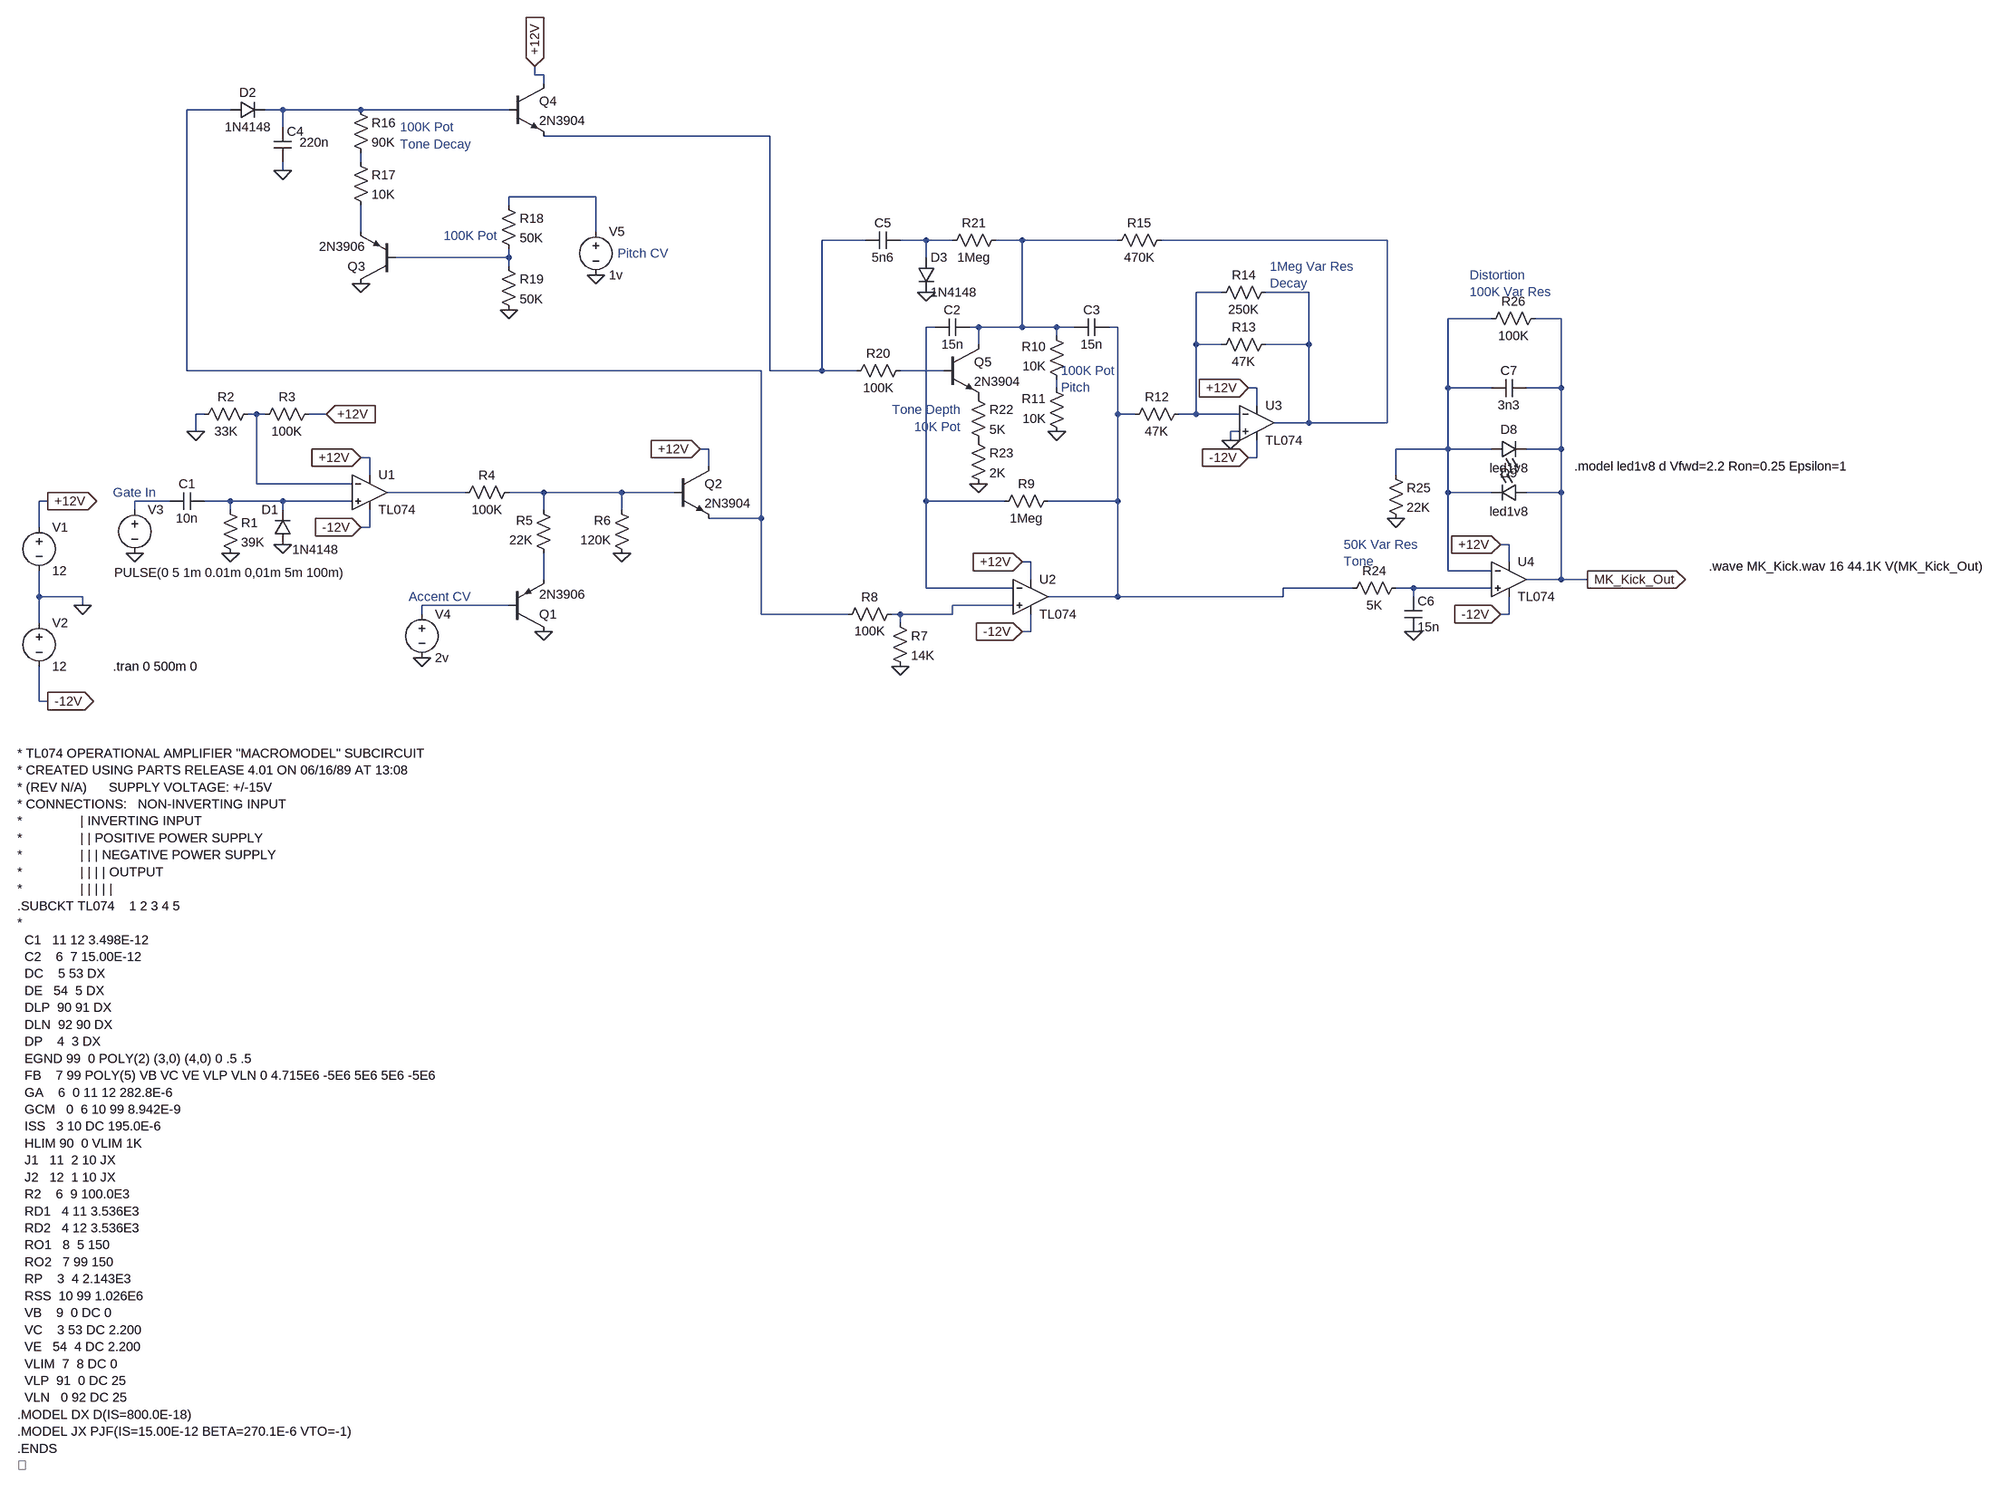
[diagram p0: schematic Kick_design.asc]
Kick_design.asc, the LTspice schematic file:
Version 4
SHEET 1 3896 1752
WIRE 736 -688 736 -704
WIRE 752 -688 736 -688
WIRE 752 -672 752 -688
WIRE 176 -624 96 -624
WIRE 272 -624 240 -624
WIRE 416 -624 272 -624
WIRE 688 -624 416 -624
WIRE 272 -592 272 -624
WIRE 1168 -576 752 -576
WIRE 416 -528 416 -544
WIRE 272 -512 272 -528
WIRE 848 -464 688 -464
WIRE 688 -448 688 -464
WIRE 416 -400 416 -448
WIRE 848 -400 848 -464
WIRE 1344 -384 1264 -384
WIRE 1456 -384 1408 -384
WIRE 1504 -384 1456 -384
WIRE 1632 -384 1584 -384
WIRE 1808 -384 1632 -384
WIRE 2304 -384 1888 -384
WIRE 688 -352 688 -368
WIRE 688 -352 480 -352
WIRE 1456 -352 1456 -384
WIRE 688 -336 688 -352
WIRE 2000 -288 1952 -288
WIRE 2160 -288 2080 -288
WIRE 2496 -240 2416 -240
WIRE 2624 -240 2576 -240
WIRE 1472 -224 1456 -224
WIRE 1552 -224 1536 -224
WIRE 1632 -224 1632 -384
WIRE 1632 -224 1552 -224
WIRE 1696 -224 1632 -224
WIRE 1728 -224 1696 -224
WIRE 1808 -224 1792 -224
WIRE 1696 -208 1696 -224
WIRE 1552 -192 1552 -224
WIRE 1952 -192 1952 -288
WIRE 2000 -192 1952 -192
WIRE 2160 -192 2160 -288
WIRE 2160 -192 2080 -192
WIRE 96 -144 96 -624
WIRE 1152 -144 96 -144
WIRE 1168 -144 1168 -576
WIRE 1264 -144 1264 -384
WIRE 1264 -144 1168 -144
WIRE 1328 -144 1264 -144
WIRE 1488 -144 1408 -144
WIRE 1696 -112 1696 -128
WIRE 2064 -112 2048 -112
WIRE 2416 -112 2416 -240
WIRE 2496 -112 2416 -112
WIRE 2624 -112 2624 -240
WIRE 2624 -112 2560 -112
WIRE 2064 -80 2064 -112
WIRE 128 -64 112 -64
WIRE 224 -64 208 -64
WIRE 240 -64 224 -64
WIRE 352 -64 320 -64
WIRE 1808 -64 1808 -224
WIRE 1840 -64 1808 -64
WIRE 1952 -64 1952 -192
WIRE 1952 -64 1920 -64
WIRE 2032 -64 1952 -64
WIRE 2160 -48 2160 -192
WIRE 2160 -48 2096 -48
WIRE 2304 -48 2304 -384
WIRE 2304 -48 2160 -48
WIRE 112 -32 112 -64
WIRE 2032 -32 2016 -32
WIRE 2016 -16 2016 -32
WIRE 1056 0 1040 0
WIRE 2416 0 2416 -112
WIRE 2416 0 2320 0
WIRE 2496 0 2416 0
WIRE 2624 0 2624 -112
WIRE 2624 0 2560 0
WIRE 432 16 416 16
WIRE 2064 16 2064 -16
WIRE 2064 16 2048 16
WIRE 1056 32 1056 0
WIRE 432 48 432 16
WIRE 2320 48 2320 0
WIRE 224 64 224 -64
WIRE 400 64 224 64
WIRE 608 80 464 80
WIRE 752 80 688 80
WIRE 896 80 752 80
WIRE 992 80 896 80
WIRE 2416 80 2416 0
WIRE 2496 80 2416 80
WIRE 2624 80 2624 0
WIRE 2624 80 2560 80
WIRE -160 96 -176 96
WIRE 64 96 0 96
WIRE 176 96 128 96
WIRE 272 96 176 96
WIRE 400 96 272 96
WIRE 1456 96 1456 -224
WIRE 1600 96 1456 96
WIRE 1808 96 1808 -64
WIRE 1808 96 1680 96
WIRE 0 112 0 96
WIRE 176 112 176 96
WIRE 272 112 272 96
WIRE 752 112 752 80
WIRE 896 112 896 80
WIRE 1152 128 1152 -144
WIRE 1152 128 1056 128
WIRE -176 144 -176 96
WIRE 432 144 432 112
WIRE 432 144 416 144
WIRE 2528 176 2512 176
WIRE 1648 208 1632 208
WIRE 2528 208 2528 176
WIRE 2416 224 2416 80
WIRE 2496 224 2416 224
WIRE 752 240 752 192
WIRE 1648 240 1648 208
WIRE 2624 240 2624 80
WIRE 2624 240 2560 240
WIRE 2672 240 2624 240
WIRE 1456 256 1456 96
WIRE 1616 256 1456 256
WIRE 2240 256 2112 256
WIRE 2352 256 2320 256
WIRE 2496 256 2352 256
WIRE -176 272 -176 224
WIRE -96 272 -176 272
WIRE 1808 272 1808 96
WIRE 1808 272 1680 272
WIRE 2112 272 2112 256
WIRE 2112 272 1808 272
WIRE 2352 272 2352 256
WIRE -96 288 -96 272
WIRE 688 288 528 288
WIRE 1616 288 1504 288
WIRE 528 304 528 288
WIRE 1152 304 1152 128
WIRE 1312 304 1152 304
WIRE 1408 304 1392 304
WIRE 1504 304 1504 288
WIRE 1504 304 1408 304
WIRE 2528 304 2528 272
WIRE 2528 304 2512 304
WIRE -176 320 -176 272
WIRE 1408 320 1408 304
WIRE 1648 336 1648 304
WIRE 1648 336 1632 336
WIRE -176 464 -176 400
WIRE -160 464 -176 464
FLAG 176 192 0
FLAG 272 176 0
FLAG 752 336 0
FLAG 896 192 0
FLAG 112 -32 0
FLAG -160 96 +12V
IOPIN -160 96 Out
FLAG 416 144 -12V
IOPIN 416 144 In
FLAG -96 288 0
FLAG 0 192 0
FLAG 352 -64 +12V
IOPIN 352 -64 In
FLAG 416 16 +12V
IOPIN 416 16 In
FLAG 1040 0 +12V
IOPIN 1040 0 In
FLAG 528 384 0
FLAG 1632 336 -12V
IOPIN 1632 336 In
FLAG 1632 208 +12V
IOPIN 1632 208 In
FLAG 1408 400 0
FLAG -160 464 -12V
IOPIN -160 464 Out
FLAG 1696 -32 0
FLAG 2048 16 -12V
IOPIN 2048 16 In
FLAG 2048 -112 +12V
IOPIN 2048 -112 In
FLAG 2016 -16 0
FLAG 1552 64 0
FLAG 1456 -288 0
FLAG 416 -304 0
FLAG 736 -704 +12V
IOPIN 736 -704 In
FLAG 272 -512 0
FLAG 688 -256 0
FLAG 848 -320 0
FLAG 2512 304 -12V
IOPIN 2512 304 In
FLAG 2512 176 +12V
IOPIN 2512 176 In
FLAG 2352 336 0
FLAG 2320 128 0
FLAG 2672 240 MK_Kick_Out
IOPIN 2672 240 Out
SYMBOL cap 128 80 R90
WINDOW 0 0 32 VBottom 2
WINDOW 3 32 32 VTop 2
SYMATTR InstName C1
SYMATTR Value 10n
SYMBOL res 160 96 R0
SYMATTR InstName R1
SYMATTR Value 39K
SYMBOL diode 288 176 R180
WINDOW 0 24 64 Left 2
WINDOW 3 -87 -9 Left 2
SYMATTR InstName D1
SYMATTR Value 1N4148
SYMBOL res 224 -80 R90
WINDOW 0 0 56 VBottom 2
WINDOW 3 32 56 VTop 2
SYMATTR InstName R2
SYMATTR Value 33K
SYMBOL res 336 -80 R90
WINDOW 0 0 56 VBottom 2
WINDOW 3 32 56 VTop 2
SYMATTR InstName R3
SYMATTR Value 100K
SYMBOL res 704 64 R90
WINDOW 0 0 56 VBottom 2
WINDOW 3 32 56 VTop 2
SYMATTR InstName R4
SYMATTR Value 100K
SYMBOL res 768 208 R180
WINDOW 0 36 76 Left 2
WINDOW 3 36 40 Left 2
SYMATTR InstName R5
SYMATTR Value 22K
SYMBOL res 912 208 R180
WINDOW 0 36 76 Left 2
WINDOW 3 36 40 Left 2
SYMATTR InstName R6
SYMATTR Value 120K
SYMBOL pnp 688 336 M180
SYMATTR InstName Q1
SYMATTR Value 2N3906
SYMBOL npn 992 32 R0
SYMATTR InstName Q2
SYMATTR Value 2N3904
SYMBOL voltage -176 128 R0
WINDOW 123 0 0 Left 0
WINDOW 39 0 0 Left 0
SYMATTR InstName V1
SYMATTR Value 12
SYMBOL voltage -176 304 R0
WINDOW 123 0 0 Left 0
WINDOW 39 0 0 Left 0
SYMATTR InstName V2
SYMATTR Value 12
SYMBOL voltage 0 96 R0
WINDOW 3 -38 132 Left 2
WINDOW 123 0 0 Left 0
WINDOW 39 0 0 Left 0
SYMATTR Value PULSE(0 5 1m 0.01m 0,01m 5m 100m)
SYMATTR InstName V3
SYMBOL OpAmps\\opamp2 432 16 R0
SYMATTR InstName U1
SYMATTR Value TL074
SYMBOL voltage 528 288 R0
WINDOW 123 0 0 Left 0
WINDOW 39 0 0 Left 0
SYMATTR InstName V4
SYMATTR Value 2v
SYMBOL OpAmps\\opamp2 1648 208 R0
SYMATTR InstName U2
SYMATTR Value TL074
SYMBOL res 1392 304 R0
SYMATTR InstName R7
SYMATTR Value 14K
SYMBOL res 1408 288 R90
WINDOW 0 0 56 VBottom 2
WINDOW 3 32 56 VTop 2
SYMATTR InstName R8
SYMATTR Value 100K
SYMBOL res 1696 80 R90
WINDOW 0 0 56 VBottom 2
WINDOW 3 32 56 VTop 2
SYMATTR InstName R9
SYMATTR Value 1Meg
SYMBOL res 1712 -112 R180
WINDOW 0 36 76 Left 2
WINDOW 3 36 40 Left 2
SYMATTR InstName R10
SYMATTR Value 10K
SYMBOL res 1712 -16 R180
WINDOW 0 36 76 Left 2
WINDOW 3 36 40 Left 2
SYMATTR InstName R11
SYMATTR Value 10K
SYMBOL cap 1536 -240 R90
WINDOW 0 0 32 VBottom 2
WINDOW 3 32 32 VTop 2
SYMATTR InstName C2
SYMATTR Value 15n
SYMBOL cap 1792 -240 R90
WINDOW 0 0 32 VBottom 2
WINDOW 3 32 32 VTop 2
SYMATTR InstName C3
SYMATTR Value 15n
SYMBOL OpAmps\\opamp2 2064 -112 R0
SYMATTR InstName U3
SYMATTR Value TL074
SYMBOL res 1936 -80 R90
WINDOW 0 0 56 VBottom 2
WINDOW 3 32 56 VTop 2
SYMATTR InstName R12
SYMATTR Value 47K
SYMBOL res 2096 -208 R90
WINDOW 0 0 56 VBottom 2
WINDOW 3 32 56 VTop 2
SYMATTR InstName R13
SYMATTR Value 47K
SYMBOL res 2096 -304 R90
WINDOW 0 0 56 VBottom 2
WINDOW 3 32 56 VTop 2
SYMATTR InstName R14
SYMATTR Value 250K
SYMBOL res 1904 -400 R90
WINDOW 0 0 56 VBottom 2
WINDOW 3 32 56 VTop 2
SYMATTR InstName R15
SYMATTR Value 470K
SYMBOL diode 176 -608 R270
WINDOW 0 32 32 VTop 2
WINDOW 3 0 32 VBottom 2
SYMATTR InstName D2
SYMATTR Value 1N4148
SYMBOL cap 256 -592 R0
WINDOW 3 47 28 Left 2
SYMATTR Value 220n
SYMATTR InstName C4
SYMBOL res 400 -640 R0
SYMATTR InstName R16
SYMATTR Value 90K
SYMBOL res 400 -544 R0
SYMATTR InstName R17
SYMATTR Value 10K
SYMBOL res 672 -464 R0
SYMATTR InstName R18
SYMATTR Value 50K
SYMBOL res 672 -352 R0
SYMATTR InstName R19
SYMATTR Value 50K
SYMBOL pnp 480 -304 R180
SYMATTR InstName Q3
SYMATTR Value 2N3906
SYMBOL npn 688 -672 R0
SYMATTR InstName Q4
SYMATTR Value 2N3904
SYMBOL res 1424 -160 R90
WINDOW 0 0 56 VBottom 2
WINDOW 3 32 56 VTop 2
SYMATTR InstName R20
SYMATTR Value 100K
SYMBOL res 1600 -400 R90
WINDOW 0 0 56 VBottom 2
WINDOW 3 32 56 VTop 2
SYMATTR InstName R21
SYMATTR Value 1Meg
SYMBOL npn 1488 -192 R0
SYMATTR InstName Q5
SYMATTR Value 2N3904
SYMBOL res 1536 -112 R0
SYMATTR InstName R22
SYMATTR Value 5K
SYMBOL res 1536 -32 R0
SYMATTR InstName R23
SYMATTR Value 2K
SYMBOL diode 1440 -352 R0
SYMATTR InstName D3
SYMATTR Value 1N4148
SYMBOL cap 1408 -400 R90
WINDOW 0 0 32 VBottom 2
WINDOW 3 32 32 VTop 2
SYMATTR InstName C5
SYMATTR Value 5n6
SYMBOL voltage 848 -416 R0
WINDOW 123 0 0 Left 0
WINDOW 39 0 0 Left 0
SYMATTR InstName V5
SYMATTR Value 1v
SYMBOL OpAmps\\opamp2 2528 176 R0
SYMATTR InstName U4
SYMATTR Value TL074
SYMBOL cap 2336 272 R0
SYMATTR InstName C6
SYMATTR Value 15n
SYMBOL res 2336 240 R90
WINDOW 0 0 56 VBottom 2
WINDOW 3 32 56 VTop 2
SYMATTR InstName R24
SYMATTR Value 5K
SYMBOL res 2304 32 R0
SYMATTR InstName R25
SYMATTR Value 22K
SYMBOL res 2592 -256 R90
WINDOW 0 0 56 VBottom 2
WINDOW 3 32 56 VTop 2
SYMATTR InstName R26
SYMATTR Value 100K
SYMBOL cap 2560 -128 R90
WINDOW 0 0 32 VBottom 2
WINDOW 3 32 32 VTop 2
SYMATTR InstName C7
SYMATTR Value 3n3
SYMBOL LED 2496 16 R270
WINDOW 0 36 32 VTop 2
WINDOW 3 -4 32 VBottom 2
SYMATTR InstName D8
SYMATTR Value led1v8
SYMATTR Description Diode
SYMATTR Type diode
SYMBOL LED 2560 64 R90
WINDOW 0 -4 32 VBottom 2
WINDOW 3 36 32 VTop 2
SYMATTR InstName D9
SYMATTR Value led1v8
SYMATTR Description Diode
SYMATTR Type diode
TEXT -40 400 Left 2 !.tran 0 500m 0
TEXT -216 560 Left 2 !* TL074 OPERATIONAL AMPLIFIER "MACROMODEL" SUBCIRCUIT\n* CREATED USING PARTS RELEASE 4.01 ON 06/16/89 AT 13:08\n* (REV N/A)      SUPPLY VOLTAGE: +/-15V\n* CONNECTIONS:   NON-INVERTING INPUT\n*                | INVERTING INPUT\n*                | | POSITIVE POWER SUPPLY\n*                | | | NEGATIVE POWER SUPPLY\n*                | | | | OUTPUT\n*                | | | | |\n.SUBCKT TL074    1 2 3 4 5\n*\n  C1   11 12 3.498E-12\n  C2    6  7 15.00E-12\n  DC    5 53 DX\n  DE   54  5 DX\n  DLP  90 91 DX\n  DLN  92 90 DX\n  DP    4  3 DX\n  EGND 99  0 POLY(2) (3,0) (4,0) 0 .5 .5\n  FB    7 99 POLY(5) VB VC VE VLP VLN 0 4.715E6 -5E6 5E6 5E6 -5E6\n  GA    6  0 11 12 282.8E-6\n  GCM   0  6 10 99 8.942E-9\n  ISS   3 10 DC 195.0E-6\n  HLIM 90  0 VLIM 1K\n  J1   11  2 10 JX\n  J2   12  1 10 JX\n  R2    6  9 100.0E3\n  RD1   4 11 3.536E3\n  RD2   4 12 3.536E3\n  RO1   8  5 150\n  RO2   7 99 150\n  RP    3  4 2.143E3\n  RSS  10 99 1.026E6\n  VB    9  0 DC 0\n  VC    3 53 DC 2.200\n  VE   54  4 DC 2.200\n  VLIM  7  8 DC 0\n  VLP  91  0 DC 25\n  VLN   0 92 DC 25\n.MODEL DX D(IS=800.0E-18)\n.MODEL JX PJF(IS=15.00E-12 BETA=270.1E-6 VTO=-1)\n.ENDS\n
TEXT 504 272 Left 2 ;Accent CV
TEXT -40 80 Left 2 ;Gate In
TEXT 1704 -144 Left 2 ;100K Pot\nPitch
TEXT 2088 -336 Left 2 ;1Meg Var Res\nDecay
TEXT 1520 -72 Right 2 ;Tone Depth\n10K Pot
TEXT 888 -360 Left 2 ;Pitch CV
TEXT 568 -392 Left 2 ;100K Pot
TEXT 488 -592 Left 2 ;100K Pot\nTone Decay
TEXT 2456 -320 Left 2 ;Distortion\n100K Var Res
TEXT 2224 176 Left 2 ;50K Var Res\nTone
TEXT 2896 216 Left 2 !.wave MK_Kick.wav 16 44.1K V(MK_Kick_Out)
TEXT 2648 32 Left 2 !.model led1v8 d Vfwd=2.2 Ron=0.25 Epsilon=1

The netlist it stands for:
* Kick_design.asc
C1 N021 N020 10n
R1 N021 0 39K
D1 0 N021 1N4148
R2 N017 0 33K
R3 +12V N017 100K
R4 N019 N018 100K
R5 N022 N019 22K
R6 0 N019 120K
Q1 0 N024 N022 0 2N3906
Q2 +12V N019 N001 0 2N3904
V1 +12V 0 12
V2 0 -12V 12
V3 N020 0 PULSE(0 5 1m 0.01m 0,01m 5m 100m)
XU1 N021 N017 +12V -12V N018 TL074  ; pins In+ In- V+ V- OUT
V4 N024 0 2v
XU2 N025 N013 +12V -12V N014 TL074  ; pins In+ In- V+ V- OUT
R7 N025 0 14K
R8 N025 N001 100K
R9 N014 N013 1Meg
R10 N016 N008 10K
R11 0 N016 10K
C2 N008 N013 15n
C3 N014 N008 15n
XU3 0 N011 +12V -12V N009 TL074  ; pins In+ In- V+ V- OUT
R12 N011 N014 47K
R13 N009 N011 47K
R14 N009 N011 250K
R15 N009 N008 470K
D2 N001 N002 1N4148
C4 N002 0 220n
R16 N002 N004 90K
R17 N004 N006 10K
R18 N005 N010 50K
R19 N010 0 50K
Q3 0 N010 N006 0 2N3906
Q4 +12V N002 N003 0 2N3904
R20 N015 N003 100K
R21 N008 N007 1Meg
Q5 N008 N015 P001 0 2N3904
R22 P001 P002 5K
R23 P002 0 2K
D3 N007 0 1N4148
C5 N007 N003 5n6
V5 N005 0 1v
XU4 N023 N012 +12V -12V MK_Kick_Out TL074  ; pins In+ In- V+ V- OUT
C6 N023 0 15n
R24 N023 N014 5K
R25 N012 0 22K
R26 MK_Kick_Out N012 100K
C7 MK_Kick_Out N012 3n3
D8 N012 MK_Kick_Out led1v8
D9 MK_Kick_Out N012 led1v8
.model D D
.lib standard.dio
.model NPN NPN
.model PNP PNP
.lib standard.bjt
.tran 0 500m 0
* TL074 OPERATIONAL AMPLIFIER "MACROMODEL" SUBCIRCUIT
* CREATED USING PARTS RELEASE 4.01 ON 06/16/89 AT 13:08
* (REV N/A)      SUPPLY VOLTAGE: +/-15V
* CONNECTIONS:   NON-INVERTING INPUT
*                | INVERTING INPUT
*                | | POSITIVE POWER SUPPLY
*                | | | NEGATIVE POWER SUPPLY
*                | | | | OUTPUT
*                | | | | |
.SUBCKT TL074    1 2 3 4 5
*
  C1   11 12 3.498E-12
  C2    6  7 15.00E-12
  DC    5 53 DX
  DE   54  5 DX
  DLP  90 91 DX
  DLN  92 90 DX
  DP    4  3 DX
  EGND 99  0 POLY(2) (3,0) (4,0) 0 .5 .5
  FB    7 99 POLY(5) VB VC VE VLP VLN 0 4.715E6 -5E6 5E6 5E6 -5E6
  GA    6  0 11 12 282.8E-6
  GCM   0  6 10 99 8.942E-9
  ISS   3 10 DC 195.0E-6
  HLIM 90  0 VLIM 1K
  J1   11  2 10 JX
  J2   12  1 10 JX
  R2    6  9 100.0E3
  RD1   4 11 3.536E3
  RD2   4 12 3.536E3
  RO1   8  5 150
  RO2   7 99 150
  RP    3  4 2.143E3
  RSS  10 99 1.026E6
  VB    9  0 DC 0
  VC    3 53 DC 2.200
  VE   54  4 DC 2.200
  VLIM  7  8 DC 0
  VLP  91  0 DC 25
  VLN   0 92 DC 25
.MODEL DX D(IS=800.0E-18)
.MODEL JX PJF(IS=15.00E-12 BETA=270.1E-6 VTO=-1)
.ENDS

* Accent CV
* Gate In
* 100K Pot
* Pitch
* 1Meg Var Res
* Decay
* Tone Depth
* 10K Pot
* Pitch CV
* 100K Pot
* 100K Pot
* Tone Decay
* Distortion
* 100K Var Res
* 50K Var Res
* Tone
.wave MK_Kick.wav 16 44.1K V(MK_Kick_Out)
.model led1v8 d Vfwd=2.2 Ron=0.25 Epsilon=1
.backanno
.end